# Altium schematic sheet low_pass.SchDoc: 4TH ORDER LOWPASS
size A4; Organization: Altium Limited; Address1: L3, 12a Rodborough Rd; Address2: Frenchs Forest; Address3: NSW; Address4: Australia 2086; DocumentNumber: 1; Revision: 1
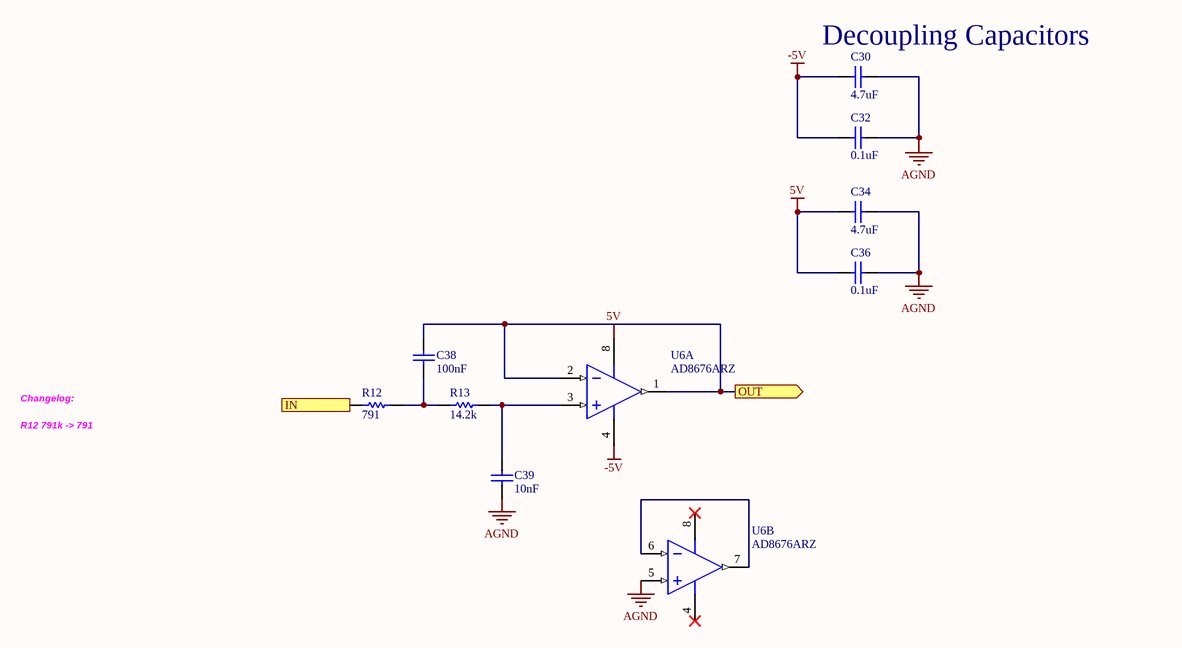
[diagram p0: low_pass.SchDoc]

## Parts
C30  4.7uF  [0402_Cap]
C32  0.1uF  [0402_Cap]
C34  4.7uF  [0402_Cap]
C36  0.1uF  [0402_Cap]
C38  100nF  [0402_Cap]
C39  10nF  [0402_Cap]
R12  791  [0402_Res]
R13  14.2k  [0402_Res]
U6  AD8676ARZ  [ADI-R-8_M]  (parts A,B of 2)

## Ports
IN (in), OUT (out)

## Nets
5V: C34.1 C36.1 U6.8(+V)
-5V: C30.1 C32.1 U6.4(-V)
AGND: C30.2 C32.2 C34.2 C36.2 C39.1 U6.5(+IN_B)
IN: R12.1 ; port IN
OUT: C38.2 U6.1(OUT_A) U6.2(-IN_A) ; port OUT
NetC38_1: C38.1 R12.2 R13.1
NetC39_2: C39.2 R13.2 U6.3(+IN_A)
NetU6_6: U6.6(-IN_B) U6.7(OUT_B)

## Notes on the sheet
- (near C30) Decoupling Capacitors
- Changelog:
- R12 791k -> 791
- Title
- Date:
- RE:
- Arturo di Girolamo
- Size:
- A3
- A

## Library data of the parts
C30 C34 = CL21A475KAQNNNE: Capacitor, 4.7uF, 0805; Value: .01uf; ASYPN: GRM155R61A475MEAAD; MFGPN: CL21A475KAQNNNE
C32 C36 = CL21B104KACNNNC: Capacitor, 0.1uF, 0805; Value: .01uf; ASYPN: 0402YC104KAT2A; MFGPN: CL21B104KACNNNC
C38 = 08051C163JAT2A: Capacitor, 16nF, 0805, 25V; ASYPN: 0402YC104KAT2A; Value: 16nF; MFGPN: 08051C163JAT2A
C39 = GRM2165C2A162JA01D: Capacitor, 1.6nF, 0805, 25V; ASYPN: 0402B103K6R3CT; Value: 1.6nF; MFGPN: GRM2165C2A162JA01D
R12 = RC0805FR-071K65L: 1.65k; ASYPN: RMCF0402FT787K; Value: 1.65k; MFGPN: RC0805FR-071K65L
R13 = RC0805FR-075K9L: 5.9k; ASYPN: TNPW040214K2BEED; Value: 5.9k; MFGPN: RC0805FR-075K9L
U6 = CMP-0384-01145-2: Double Channel Wide Bandwidth Operational Amplifier, 10 MHz BW, 2.5 V/us SR, Industrial, 8-pin SOIC (R-8), Tube; Generic Part Number: AD8676; Manufacturer: Analog Devices; Input Offset Voltage: 12uV; Input Bias Current: 2.4nA; V Span Min: 10V; Iq/Amp: 2.7mA; V Span Max: 36V; Small Signal Bandwidth: 10MHz; Amplifiers Per Package: 2; Code_JEDEC: MS-012-AA; Mounting Technology: Surface Mount; Slew Rate: 2.5V/us; DatasheetVersion: Rev. C; ComponentLink2Description: Datasheet; ComponentLink3Description: Package Specification; PackageReference: R-8; ComponentLink1URL: http://www.analog.com/en/index.html; RevisionNote: Reference Circuit URL fixed; ComponentLink1Description: Manufacturer URL; ComponentLink2URL: http://www.analog.com/static/imported-files/data_sheets/AD8676.pdf; ComponentLink3URL: http://www.analog.com/static/imported-files/packages/PKG_PDF/SOIC_Narrow%20(R)/R_8.pdf; ComponentLink4Description: Reference Circuit; ComponentLink4URL: http://www.analog.com/en/all-operational-amplifiers-op-amps/operational-amplifiers-op-amps/ad8676/products/product.html#product-recommendations; PackageDescription: 8-Pin Standard Small Outline Package, Body 3.9 x 4.9 mm, Pitch 1.27 mm; PartNumber: AD8676ARZ; PackageVersion: 060506-A; ASYPN: AD8676ARZ